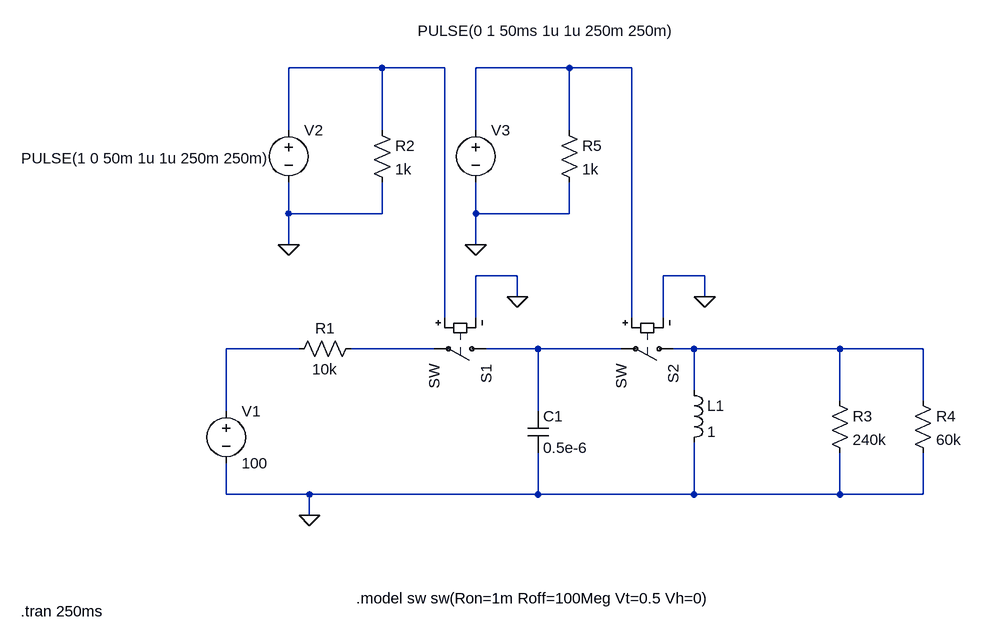
[diagram p0: schematic switching_success.asc]
switching_success.asc, the LTspice schematic file:
Version 4
SHEET 1 880 680
WIRE -16 -320 -160 -320
WIRE 80 -320 -16 -320
WIRE 272 -320 128 -320
WIRE 368 -320 272 -320
WIRE -160 -224 -160 -320
WIRE -16 -224 -16 -320
WIRE 128 -224 128 -320
WIRE 272 -224 272 -320
WIRE -160 -96 -160 -144
WIRE -16 -96 -16 -144
WIRE -16 -96 -160 -96
WIRE 128 -96 128 -144
WIRE 272 -96 272 -144
WIRE 272 -96 128 -96
WIRE -160 -48 -160 -96
WIRE 128 -48 128 -96
WIRE 192 0 128 0
WIRE 480 0 416 0
WIRE 192 32 192 0
WIRE 480 32 480 0
WIRE 80 64 80 -320
WIRE 128 64 128 0
WIRE 368 64 368 -320
WIRE 416 64 416 0
WIRE -144 112 -256 112
WIRE 64 112 -64 112
WIRE 224 112 144 112
WIRE 352 112 224 112
WIRE 464 112 432 112
WIRE 688 112 464 112
WIRE 816 112 688 112
WIRE 464 176 464 112
WIRE 688 192 688 112
WIRE 816 192 816 112
WIRE -256 208 -256 112
WIRE 224 208 224 112
WIRE -256 336 -256 288
WIRE -128 336 -256 336
WIRE 224 336 224 272
WIRE 224 336 -128 336
WIRE 464 336 464 256
WIRE 464 336 224 336
WIRE 688 336 688 272
WIRE 688 336 464 336
WIRE 816 336 816 272
WIRE 816 336 688 336
WIRE -128 368 -128 336
FLAG -160 -48 0
FLAG -128 368 0
FLAG 480 32 0
FLAG 192 32 0
FLAG 128 -48 0
SYMBOL sw 160 112 R90
SYMATTR InstName S1
SYMBOL sw 448 112 R90
SYMATTR InstName S2
SYMBOL res -48 96 R90
WINDOW 0 0 56 VBottom 2
WINDOW 3 32 56 VTop 2
SYMATTR InstName R1
SYMATTR Value 10k
SYMBOL voltage -256 192 R0
WINDOW 123 0 0 Left 0
WINDOW 39 0 0 Left 0
SYMATTR InstName V1
SYMATTR Value 100
SYMBOL voltage -160 -240 R0
WINDOW 3 -411 59 Left 2
WINDOW 123 0 0 Left 0
WINDOW 39 0 0 Left 0
SYMATTR InstName V2
SYMATTR Value PULSE(1 0 50m 1u 1u 250m 250m)
SYMBOL res -32 -240 R0
SYMATTR InstName R2
SYMATTR Value 1k
SYMBOL cap 208 208 R0
SYMATTR InstName C1
SYMATTR Value 0.5e-6
SYMATTR SpiceLine IC=0
SYMBOL res 672 176 R0
SYMATTR InstName R3
SYMATTR Value 240k
SYMBOL res 800 176 R0
SYMATTR InstName R4
SYMATTR Value 60k
SYMBOL voltage 128 -240 R0
WINDOW 3 -89 -137 Left 2
WINDOW 123 0 0 Left 0
WINDOW 39 0 0 Left 0
SYMATTR InstName V3
SYMATTR Value PULSE(0 1 50ms 1u 1u 250m 250m)
SYMBOL res 256 -240 R0
SYMATTR InstName R5
SYMATTR Value 1k
SYMBOL ind 448 160 R0
SYMATTR InstName L1
SYMATTR Value 1
TEXT -56 496 Left 2 !.model sw sw(Ron=1m Roff=100Meg Vt=0.5 Vh=0)
TEXT -572 516 Left 2 !.tran 250ms

The netlist it stands for:
* switching_success.asc
S1 N005 N004 N001 0 SW
S2 N006 N005 N002 0 SW
R1 N004 N003 10k
V1 N003 0 100
V2 N001 0 PULSE(1 0 50m 1u 1u 250m 250m)
R2 N001 0 1k
C1 N005 0 0.5e-6 IC=0
R3 N006 0 240k
R4 N006 0 60k
V3 N002 0 PULSE(0 1 50ms 1u 1u 250m 250m)
R5 N002 0 1k
L1 N006 0 1
.model sw sw(Ron=1m Roff=100Meg Vt=0.5 Vh=0)
.tran 250ms
.backanno
.end